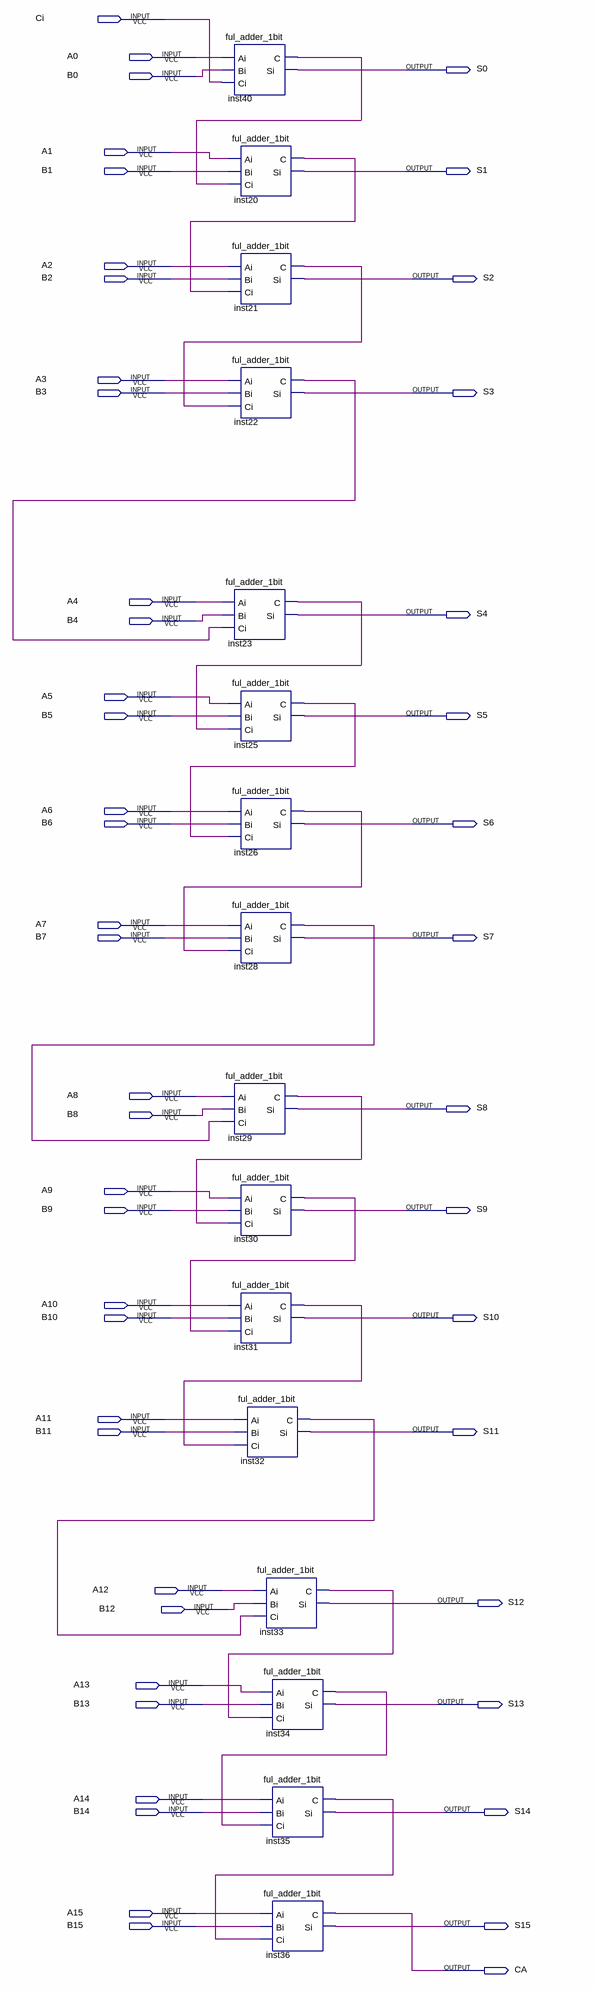
[diagram p0: schematic sheet]
// Quartus schematic RCA_16_LOW.bdf as structural Verilog: 16 symbols, 50 pins
module RCA_16_LOW (
  input  Ci,
  input  A0,
  input  B0,
  input  A1,
  input  B1,
  input  A2,
  input  B2,
  input  A3,
  input  B3,
  input  A4,
  input  B4,
  input  A5,
  input  B5,
  input  A6,
  input  B6,
  input  A7,
  input  B7,
  input  A8,
  input  B8,
  input  A9,
  input  B9,
  input  A10,
  input  B10,
  input  A11,
  input  B11,
  input  A12,
  input  B12,
  input  A13,
  input  B13,
  input  A14,
  input  B14,
  input  A15,
  input  B15,
  output S0,
  output S1,
  output S2,
  output S3,
  output S4,
  output S5,
  output S6,
  output S7,
  output S8,
  output S9,
  output S10,
  output S11,
  output S12,
  output S13,
  output S14,
  output S15,
  output CA
);

  wire inst20_c, inst21_c, inst22_c, inst23_c, inst25_c, inst26_c, inst28_c, inst29_c, inst30_c, inst31_c,
       inst32_c, inst33_c, inst34_c, inst35_c, inst40_c;

  ful_adder_1bit inst40 (.Ai(A0), .Bi(B0), .Ci(Ci), .C(inst40_c), .Si(S0));
  ful_adder_1bit inst20 (.Ai(A1), .Bi(B1), .Ci(inst40_c), .C(inst20_c), .Si(S1));
  ful_adder_1bit inst21 (.Ai(A2), .Bi(B2), .Ci(inst20_c), .C(inst21_c), .Si(S2));
  ful_adder_1bit inst22 (.Ai(A3), .Bi(B3), .Ci(inst21_c), .C(inst22_c), .Si(S3));
  ful_adder_1bit inst23 (.Ai(A4), .Bi(B4), .Ci(inst22_c), .C(inst23_c), .Si(S4));
  ful_adder_1bit inst25 (.Ai(A5), .Bi(B5), .Ci(inst23_c), .C(inst25_c), .Si(S5));
  ful_adder_1bit inst26 (.Ai(A6), .Bi(B6), .Ci(inst25_c), .C(inst26_c), .Si(S6));
  ful_adder_1bit inst28 (.Ai(A7), .Bi(B7), .Ci(inst26_c), .C(inst28_c), .Si(S7));
  ful_adder_1bit inst29 (.Ai(A8), .Bi(B8), .Ci(inst28_c), .C(inst29_c), .Si(S8));
  ful_adder_1bit inst30 (.Ai(A9), .Bi(B9), .Ci(inst29_c), .C(inst30_c), .Si(S9));
  ful_adder_1bit inst31 (.Ai(A10), .Bi(B10), .Ci(inst30_c), .C(inst31_c), .Si(S10));
  ful_adder_1bit inst32 (.Ai(A11), .Bi(B11), .Ci(inst31_c), .C(inst32_c), .Si(S11));
  ful_adder_1bit inst33 (.Ai(A12), .Bi(B12), .Ci(inst32_c), .C(inst33_c), .Si(S12));
  ful_adder_1bit inst34 (.Ai(A13), .Bi(B13), .Ci(inst33_c), .C(inst34_c), .Si(S13));
  ful_adder_1bit inst35 (.Ai(A14), .Bi(B14), .Ci(inst34_c), .C(inst35_c), .Si(S14));
  ful_adder_1bit inst36 (.Ai(A15), .Bi(B15), .Ci(inst35_c), .C(CA), .Si(S15));
endmodule
